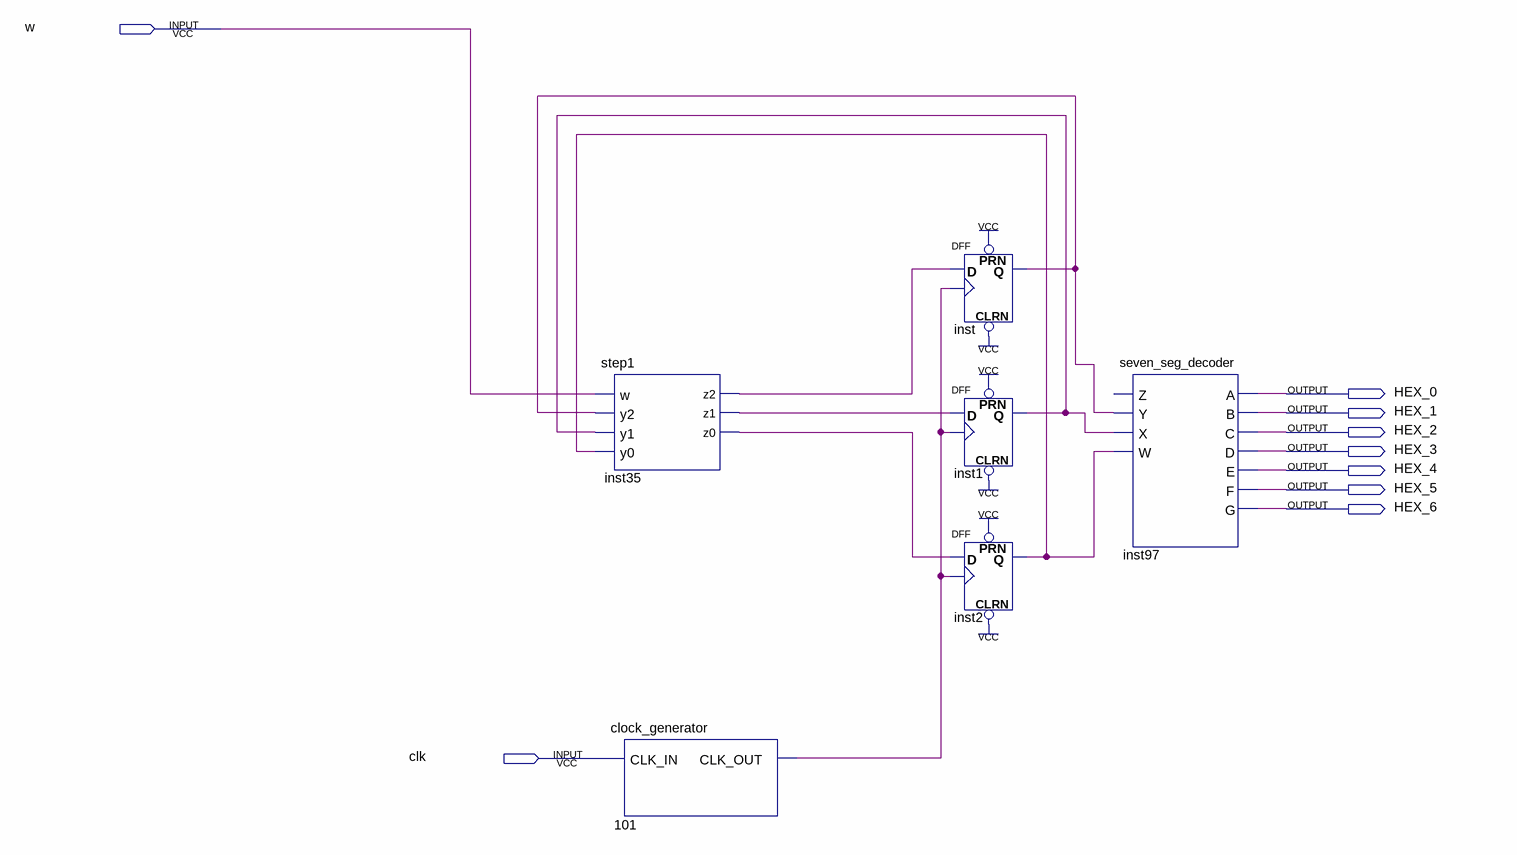
[diagram p0: schematic sheet]
// Quartus schematic lab11step1.bdf as structural Verilog: 6 symbols, 9 pins
module lab11step1 (
  input  w,
  input  clk,
  output HEX_0,
  output HEX_1,
  output HEX_2,
  output HEX_3,
  output HEX_4,
  output HEX_5,
  output HEX_6
);

  wire inst1_q, inst2_q, inst35_z0, inst35_z1, inst35_z2, inst_q, n101_clk_out;

  step1 inst35 (.w(w), .y2(inst_q), .y1(inst1_q), .y0(inst2_q), .z2(inst35_z2), .z1(inst35_z1), .z0(inst35_z0));
  clock_generator u_101 (.CLK_IN(clk), .CLK_OUT(n101_clk_out));
  DFF inst (.CLRN(1'b1), .CLK(n101_clk_out), .D(inst35_z2), .PRN(1'b1), .Q(inst_q));
  DFF inst1 (.CLRN(1'b1), .CLK(n101_clk_out), .D(inst35_z1), .PRN(1'b1), .Q(inst1_q));
  DFF inst2 (.CLRN(1'b1), .CLK(n101_clk_out), .D(inst35_z0), .PRN(1'b1), .Q(inst2_q));
  seven_seg_decoder inst97 (
    .Y(inst_q), .X(inst1_q), .W(inst2_q), .A(HEX_0), .B(HEX_1), .C(HEX_2), .D(HEX_3), .E(HEX_4), .F(HEX_5),
    .G(HEX_6));  // open: Z
endmodule
